# Altium schematic sheet integrator_4pole.SchDoc: Active Integrator
size A; Engineer: A. Peck; Organization: UCLA High Energy Physics; DocumentNumber: 12; Revision: 3.0; SheetNumber: 12; SheetTotal: 15; Project: LCT Comparator Tester
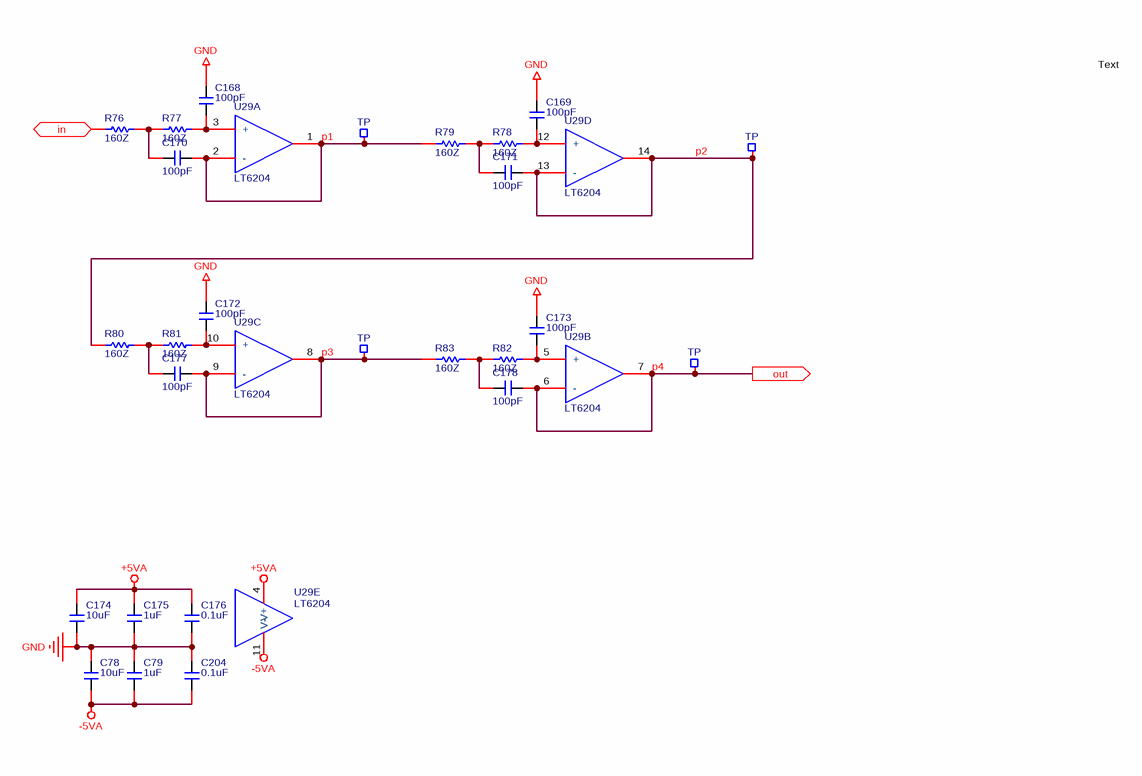
[diagram p0: integrator_4pole.SchDoc]

## Parts
C78  10uF  [c1206]
C79  1uF  [C0603]
C168  100pF  [C0603]
C169  100pF  [C0603]
C170  100pF  [C0603]
C171  100pF  [C0603]
C172  100pF  [C0603]
C173  100pF  [C0603]
C174  10uF  [c1206]
C175  1uF  [C0603]
C176  0.1uF  [C0603]
C177  100pF  [C0603]
C178  100pF  [C0603]
C204  0.1uF  [C0603]
R76  160Z  [R0603]
R77  160Z  [R0603]
R78  160Z  [R0603]
R79  160Z  [R0603]
R80  160Z  [R0603]
R81  160Z  [R0603]
R82  160Z  [R0603]
R83  160Z  [R0603]
TP8  TP  [TP_MICRO]  (no BOM)
TP33  TP  [TP_MICRO]  (no BOM)
TP34  TP  [TP_MICRO]  (no BOM)
TP35  TP  [TP_MICRO]  (no BOM)
U29  LT6204  [SOIC-14]  (parts A,B,C,D,E of 5)

## Ports
in (in), out (out)

## Nets
+5VA: C174.1 C175.2 C176.2 U29.4(V+)
-5VA: C78.2 C79.1 C204.1 U29.11(V-)
GND: C78.1 C79.2 C168.2 C169.2 C172.2 C173.2 C174.2 C175.1 C176.1 C204.2
in: R76.1 ; port in
p1: C170.2 R79.1 TP8.1 U29.1(OUT) U29.2(-)
p2: C171.2 R80.1 TP33.1 U29.13(-) U29.14(OUT)
p3: C177.2 R83.1 TP34.1 U29.8(OUT) U29.9(-)
p4: C178.2 TP35.1 U29.6(-) U29.7(OUT) ; port out
NetC168_1: C168.1 R77.2 U29.3(+)
NetC169_1: C169.1 R78.2 U29.12(+)
NetC170_1: C170.1 R76.2 R77.1
NetC171_1: C171.1 R78.1 R79.2
NetC172_1: C172.1 R81.2 U29.10(+)
NetC173_1: C173.1 R82.2 U29.5(+)
NetC177_1: C177.1 R80.2 R81.1
NetC178_1: C178.1 R82.1 R83.2

## Notes on the sheet
- Text
- Date:
- Rev:
- of
- Sheet

## Library data of the parts
C78 C174 = CAP/GMK316F106ZL-T: CAP-CER, 2, 10uF, 10%, 35V, 1206; Manufacturer: Taiyo Yuden; Capacitance: 10µF; Tolerance: -20%, +80%; Temperature Coefficient: Y5V (F); Supplier 1: Digi-Key; Manufacturer Part Number: GMK316F106ZL-T; RoHS: RoHS Compliant; Category: Capacitors; Packaging: Cut Tape (CT); Voltage - Rated: 35V; Mounting Type: Surface Mount, MLCC; Operating Temperature: -30°C ~ 85°C; Package / Case: 1206 (3216 Metric); Size / Dimension: 0.126" L x 0.063" W (3.20mm x 1.60mm); Height - Seated (Max): -; Lead Spacing: -; Features: -; ComponentLink1URL: http://ds.yuden.co.jp/TYCOMPAS/ut/detail.do?productNo=GMK316F106ZL-T&fileName=GMK316F106ZL-T_SS&mode=specSheetDownload; ComponentLink1Description: http://ds.yuden.co.jp/TYCOMPAS/ut/detail.do?productNo=GMK316F106ZL-T&fileName=GMK316F106ZL-T_SS&mode=specSheetDownload; Supplier Part Number 1: 587-1352-1-ND; Stock 1: 249989; Pricing 1: 1=0.46, 10=0.345, 50=0.2012, 100=0.161, 250=0.115, 500=0.0782, 1000=0.06325 (USD); Applications: General Purpose; Ratings: -; Thickness (Max): 0.071" (1.80mm); Lead Style: -
C79 C175 = Murata/GRM188R61E105KA12D: CAP-CER, 2, 1.0uF, 10%, 25V, 0603; Manufacturer: Murata Electronics North America; Capacitance: 1µF; Temperature Coefficient: X5R; Supplier 1: Digi-Key; Supplier Part Number 1: 490-3897-1-ND; Manufacturer Part Number: GRM188R61E105KA12D; RoHS: RoHS Compliant; Category: Capacitors; Stock 1: 1899119; Pricing 1: 1=0.1, 10=0.036, 50=0.0196, 100=0.0165, 250=0.01352, 500=0.01156, 1000=0.009 (USD); Packaging: Cut Tape (CT); Tolerance: ±10%; Voltage - Rated: 25V; Mounting Type: Surface Mount, MLCC; Operating Temperature: -55°C ~ 85°C; Applications: General Purpose; Ratings: -; Package / Case: 0603 (1608 Metric); Size / Dimension: 0.063" L x 0.031" W (1.60mm x 0.80mm); Height - Seated (Max): -; Thickness (Max): 0.035" (0.90mm); Lead Spacing: -; Features: -; Lead Style: -; ComponentLink1URL: http://www.murata.com/~/media/webrenewal/support/library/catalog/products/capacitor/mlcc/c02e.pdf; ComponentLink1Description: http://www.murata.com/~/media/webrenewal/support/library/catalog/products/capacitor/mlcc/c02e.pdf
C168-C173 C177 C178 = AVX/06035A101KAT2A: CAP-CER, 0, 100pF, 10%, 50V, 0603; Manufacturer: AVX Corporation; Temperature Coefficient: C0G, NP0; Supplier 1: Digi-Key; Supplier Part Number 1: 478-3717-1-ND; Manufacturer Part Number: 06035A101KAT2A; RoHS: RoHS Compliant; Category: Capacitors; Stock 1: 55355; Pricing 1: 1=0.16, 10=0.117, 25=0.0856, 50=0.0664, 100=0.0551, 250=0.04556, 500=0.03862, 1000=0.03197 (USD); Packaging: Cut Tape (CT); Part Status: Active; Capacitance: 100pF; Tolerance: ±10%; Voltage - Rated: 50V; Operating Temperature: -55°C ~ 125°C; Features: -; Ratings: -; Applications: General Purpose; Failure Rate: *; Mounting Type: Surface Mount, MLCC; Package / Case: 0603 (1608 Metric); Size / Dimension: 0.063" L x 0.032" W (1.60mm x 0.81mm); Height - Seated (Max): -; Thickness (Max): 0.035" (0.90mm); Lead Spacing: -; Lead Style: -; ComponentLink1URL: http://catalogs.avx.com/SurfaceMount.pdf; ComponentLink1Description: http://catalogs.avx.com/SurfaceMount.pdf
C176 C204 = CAP/06035C104KAT2A: CAP-CER, 2, 0.1uF, 10%, 50V, 0603, X7R; Manufacturer: AVX Corporation; Capacitance: 0.10µF; Supplier 1: Digi-Key; Manufacturer Part Number: 06035C104KAT2A; RoHS: RoHS Compliant; Category: Capacitors; Stock 1: 4412408; Pricing 1: 1=0.1, 10=0.036, 25=0.0264, 50=0.0198, 100=0.0162, 250=0.01352, 500=0.01156, 1000=0.00908 (USD); Packaging: Cut Tape (CT); Tolerance: ±10%; Voltage - Rated: 50V; Temperature Coefficient: X7R; Mounting Type: Surface Mount, MLCC; Operating Temperature: -55°C ~ 125°C; Applications: General Purpose; Ratings: -; Package / Case: 0603 (1608 Metric); Size / Dimension: 0.063" L x 0.032" W (1.60mm x 0.81mm); Height - Seated (Max): -; Thickness (Max): 0.035" (0.90mm); Lead Spacing: -; Features: -; Lead Style: -; ComponentLink1URL: http://datasheets.avx.com/X7RDielectric.pdf; ComponentLink1Description: http://datasheets.avx.com/X7RDielectric.pdf; Supplier Part Number 1: 478-5052-1-ND; Supplier 2: Newark; Supplier Part Number 2: 54K2412
R76-R83 = CRCW0603160RFKEA: RES0, SMD,  160Z, 1.0%, 1/10W, 0603; Manufacturer: Vishay Dale; Resistance (Ohms): 160; Tolerance: ±1%; Power (Watts): 0.1W, 1/10W; Temperature Coefficient: ±100ppm/°C; Supplier 1: Digi-Key; Manufacturer Part Number: CRCW0603160RFKEA; RoHS: RoHS Compliant; Category: Resistors; Stock 1: 48671; Pricing 1: 1=0.1, 10=0.03, 25=0.022, 50=0.0168, 100=0.0123, 250=0.0094, 500=0.00752, 1000=0.00554, 2500=0.00481 (USD); Packaging: Cut Tape (CT); Part Status: Active; Composition: Thick Film; Features: Automotive AEC-Q200; Operating Temperature: -55°C ~ 155°C; Package / Case: 0603 (1608 Metric); Supplier Device Package: 0603; Size / Dimension: 0.063" L x 0.033" W (1.60mm x 0.85mm); Height - Seated (Max): 0.020" (0.50mm); Number of Terminations: 2; Failure Rate: -; ComponentLink1URL: http://www.vishay.com/docs/20035/dcrcwe3.pdf; ComponentLink1Description: http://www.vishay.com/docs/20035/dcrcwe3.pdf; Supplier Part Number 1: 541-160HCT-ND
TP8 TP33-TP35 = TP_MICRO: Test Point, Round, Small
U29 = LT6204 SOIC-14: OPA, 100MHz, Quad, RRIO, Unity Stable; Supplier 1: Digi-Key; Supplier Part Number 1: LT6204CS#PBF-ND